# Altium schematic sheet Sheet2.SchDoc: Team VitaSync
size A; DrawnBy: Thennakoon U.I.D.; SheetNumber: 1; SheetTotal: 1
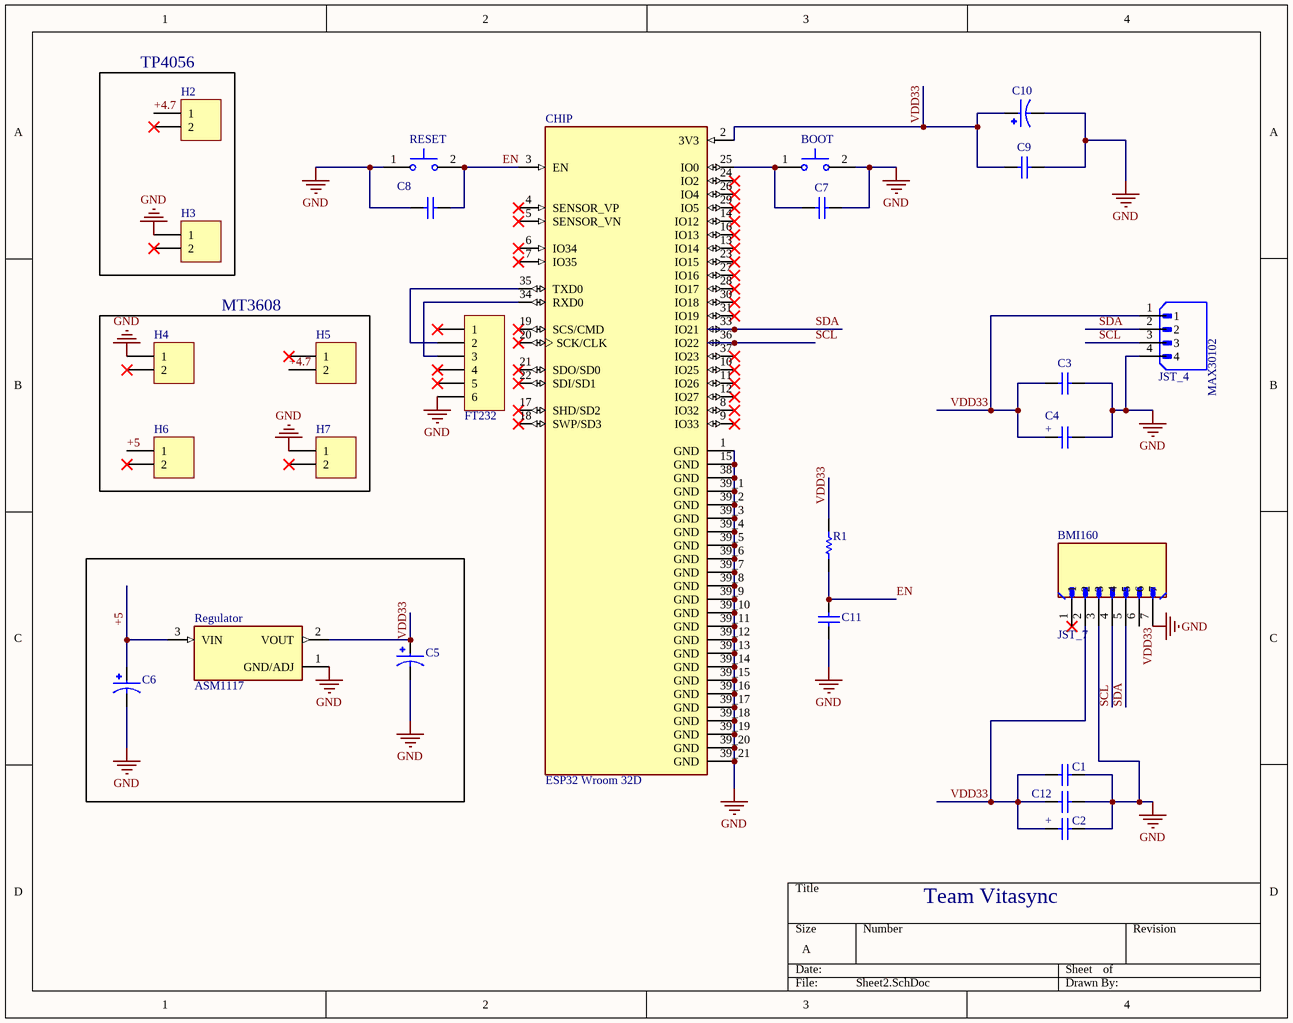
[diagram p0: Sheet2.SchDoc]

## Parts
BMI160  JST_7  [JST_7]
BOOT  (no value)  [SW_BUTT-2]
C1  Ceramic Capacitor  [Ceramic Capacitor]  (value not drawn)
C2  Capacitor 10uF  [Capacitor 10uF]  (value not drawn)
C3  Ceramic Capacitor  [Ceramic Capacitor]  (value not drawn)
C4  Capacitor 10uF  [Capacitor 10uF]  (value not drawn)
C5  EEUHD1H220  [CAPPRD250W50D500H1100]  (value not drawn)
C6  EEUHD1H220  [CAPPRD250W50D500H1100]  (value not drawn)
C7  Ceramic Capacitor  [Ceramic Capacitor]  (value not drawn)
C8  Ceramic Capacitor  [Ceramic Capacitor]  (value not drawn)
C9  Ceramic Capacitor  [Ceramic Capacitor]  (value not drawn)
C10  EEUHD1H220  [CAPPRD250W50D500H1100]  (value not drawn)
C11  Ceramic Capacitor  [Ceramic Capacitor]  (value not drawn)
C12  Ceramic Capacitor  [Ceramic Capacitor]  (value not drawn)
CHIP  ESP32 Wroom 32D  [ESP32 Wroom 32D]
FT232  FEMALE_HEADER_6  [FEMALE_HEADER_6]  (value not drawn)
H2  Header_2  [HEADER_2]  (value not drawn)
H3  Header_2  [HEADER_2]  (value not drawn)
H4  Header_2  [HEADER_2]  (value not drawn)
H5  Header_2  [HEADER_2]  (value not drawn)
H6  Header_2  [HEADER_2]  (value not drawn)
H7  Header_2  [HEADER_2]  (value not drawn)
MAX30102  JST_4  [JST_4]
R1  resistor  [Resistor]  (value not drawn)
Regulator  ASM1117  [ASM1117]
RESET  BUTT-2  [SW_BUTT-2]  (value not drawn)

## Blocks framed on the sheet
TP4056: H2 H3
MT3608: H4-H7

## Nets
GND: BMI160.3 BMI160.7 BOOT.2 C1.2 C2.- C3.2 C4.- C5.N C6.N C7.2 C8.1 C9.2 C10.N C11.1 C12.2 CHIP.1(GND) CHIP.15(GND) CHIP.38(GND) CHIP.39_1(GND) CHIP.39_2(GND) CHIP.39_3(GND) CHIP.39_4(GND) CHIP.39_5(GND) CHIP.39_6(GND) CHIP.39_7(GND) CHIP.39_8(GND) CHIP.39_9(GND) CHIP.39_10(GND) CHIP.39_11(GND) CHIP.39_12(GND) CHIP.39_13(GND) CHIP.39_14(GND) CHIP.39_15(GND) CHIP.39_16(GND) CHIP.39_17(GND) CHIP.39_18(GND) CHIP.39_19(GND) CHIP.39_20(GND) CHIP.39_21(GND) FT232.6 H3.1 H4.1 H7.1 MAX30102.4 Regulator.1(GND/ADJ) RESET.1
+4.7: H2.1 H5.2
+5: C6.P H6.1 Regulator.3(VIN)
EN: C8.2 C11.2 CHIP.3(EN) R1.1 RESET.2
SCL: BMI160.4 CHIP.36(IO22) MAX30102.3
SDA: BMI160.5 CHIP.33(IO21) MAX30102.2
VDD33: BMI160.2 BMI160.6 C1.1 C2.+ C3.1 C4.+ C5.P C9.1 C10.P C12.1 CHIP.2(3V3) MAX30102.1 R1.2 Regulator.2(VOUT)
NetBOOT_1: BOOT.1 C7.1 CHIP.25(IO0)
NetCHIP_34: CHIP.34(RXD0) FT232.3
NetCHIP_35: CHIP.35(TXD0) FT232.2

Not connected (* = marked no-connect by the designer): BMI160 1*; CHIP 4(SENSOR_VP)* 5(SENSOR_VN)* 6(IO34)* 7(IO35)* 8(IO32)* 9(IO33)* 10(IO25)* 11(IO26)* 12(IO27)* 13(IO14)* 14(IO12)* 16(IO13)* 17(SHD/SD2)* 18(SWP/SD3)* 19(SCS/CMD)* 20(SCK/CLK)* 21(SDO/SD0)* 22(SDI/SD1)* 23(IO15)* 24(IO2)* 26(IO4)* 27(IO16)* 28(IO17)* 29(IO5)* 30(IO18)* 31(IO19)* 37(IO23)*; FT232 1* 4* 5*; H2 2*; H3 2*; H4 2*; H5 1*; H6 2*; H7 2*

## Notes on the sheet
- Team Vitasync

## Library data of the parts
BOOT RESET = BUTT-2: Tactile Switches MINI PUSH BUTTON SWITCH 2-PIN QTY. 4; MF: Gravitech; SnapEDA_Link: https://www.snapeda.com/parts/BUTT-2/Gravitech/view-part/?ref=snap; Package: None; Value: *; MP: BUTT-2; Check_prices: https://www.snapeda.com/parts/BUTT-2/Gravitech/view-part/?ref=eda
C5 C6 C10 = EEUHD1H220: Cap Aluminum Lytic 22uF 50V 20% (5 X 11mm) Radial 2.5mm 65mA 1000h 105C Bulk; MF: Panasonic; MP: EEU-HD1H220; SnapEDA_Link: https://www.snapeda.com/parts/EEU-HD1H220/Panasonic/view-part/?ref=snap; Purchase-URL: https://pricing.snapeda.com/search/part/EEU-HD1H220/?ref=eda; Check_prices: https://www.snapeda.com/parts/EEU-HD1H220/Panasonic/view-part/?ref=eda; Value: *; Availability: In Stock; Price: None; Package: RADIAL-2 Panasonic
C12 = Ceramic Capacitor: 10uF
R1 = resistor: 10k,0.25W